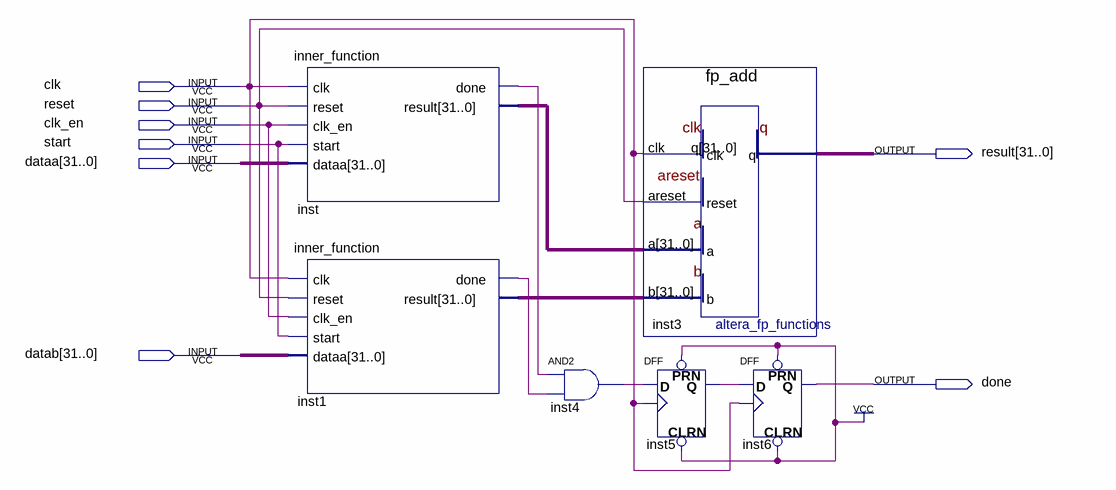
[diagram p0: schematic sheet]
// Quartus schematic double_input.bdf as structural Verilog: 6 symbols, 8 pins
module double_input (
  input  clk,
  input  reset,
  input  clk_en,
  input  start,
  input  [31:0] dataa,
  input  [31:0] datab,
  output [31:0] result,
  output done
);

  wire inst1_done, inst4_out, inst5_q, inst_done;
  wire [31:0] inst1_result, inst_result;

  inner_function inst (
    .clk(clk), .reset(reset), .clk_en(clk_en), .start(start), .dataa(dataa), .done(inst_done),
    .result(inst_result));
  inner_function inst1 (
    .clk(clk), .reset(reset), .clk_en(clk_en), .start(start), .dataa(datab), .done(inst1_done),
    .result(inst1_result));
  and inst4 (inst4_out, inst_done, inst1_done);
  fp_add inst3 (.clk(clk), .areset(reset), .a(inst_result), .b(inst1_result), .q(result));
  DFF inst5 (.CLRN(1'b1), .CLK(clk), .D(inst4_out), .PRN(1'b1), .Q(inst5_q));
  DFF inst6 (.CLRN(1'b1), .CLK(clk), .D(inst5_q), .PRN(1'b1), .Q(done));
endmodule
